# Altium schematic sheet sma-amplifier.SchDoc: SMA Amplifier
size A4; DrawnBy: Dylan Vogel; Organization: UTAT SS; DocumentNumber: 12; Revision: 2; SheetNumber: 12; SheetTotal: 13
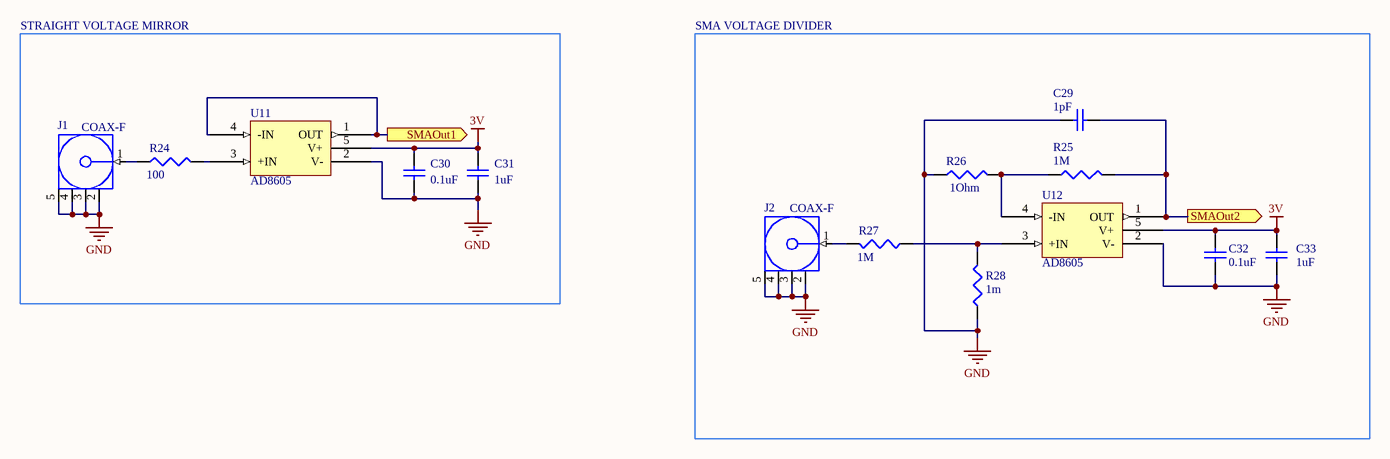
[diagram p0: sma-amplifier.SchDoc]

## Parts
C29  1pF  [0402]
C30  0.1uF  [0402]
C31  1uF  [1608[0603]]
C32  0.1uF  [0402]
C33  1uF  [1608[0603]]
J1  COAX-F  [MCX5.08-H5]
J2  COAX-F  [MCX5.08-H5]
R24  100  [0402]
R25  1M  [0402]
R26  1Ohm  [J1-0603]
R27  1M  [0402]
R28  1m  [14-1210]
U11  AD8605  [SOP-65P200X125-5N]
U12  AD8605  [SOP-65P200X125-5N]

## Blocks framed on the sheet
STRAIGHT VOLTAGE MIRROR: C30 C31 J1 R24 U11
SMA VOLTAGE DIVIDER: C29 C32 C33 J2 R25-R28 U12

## Ports
SMAOut1 (out), SMAOut2 (out)

## Nets
3V: C30.2 C31.2 C32.2 C33.2 U11.5(V+) U12.5(V+)
GND: C29.2 C30.1 C31.1 C32.1 C33.1 J1.2(GND) J1.3(GND) J1.4(GND) J1.5(GND) J2.2(GND) J2.3(GND) J2.4(GND) J2.5(GND) R26.1 R28.1 U11.2(V-) U12.2(V-)
SMAOut1: U11.1(OUT) U11.4(-IN) ; port SMAOut1
SMAOut2: C29.1 R25.2 U12.1(OUT) ; port SMAOut2
NetJ1_1: J1.1(Signal) R24.1
NetJ2_1: J2.1(Signal) R27.2
NetR24_2: R24.2 U11.3(+IN)
NetR25_1: R25.1 R26.2 U12.4(-IN)
NetR27_1: R27.1 R28.2 U12.3(+IN)

## Library data of the parts
C29-C33 = Cap Semi: Capacitor (Semiconductor SIM Model); Published: 8-Jun-2000; LatestRevisionDate: 29-May-2009; LatestRevisionNote: IPC-7351 Footprint Added.; PackageReference: C1206; Publisher: Altium Limited; PackageDescription: Chip Capacitor; Supplier: Digi-Key; Supplier 1: Digi-Key
  C29: Value: 1pF
  C30 C32: Value: 0.1uF
  C31 C33: Value: 1uF
J1 J2 = COAX-F: RF Coaxial PCB Connector, MCX; Thru-Hole, Right-Angle Mount Socket, Blunt Post Terminal, 50 Ohm Impedance; PCB_Layout: Complies with manufacturer's recommendation.; DrillSize: Corresponds to nominal value.; Published: 15-Jul-2004; LatestRevisionDate: 15-Jul-2004; LatestRevisionNote: Component Replaced.; DatasheetDocument: 30-May-2003; PackageDocument: 04-Jul-1999; PackageReference: 919-119J-51AX; Publisher: Altium Limited; ComponentLink1Description: Manufacturer Link; ComponentLink1URL: http://www.amphenolrf.com/; Supplier 1: Digi-Key
R24-R28 = Res3: Resistor; Published: 8-Jun-2000; LatestRevisionDate: 29-May-2009; LatestRevisionNote: IPC-7351 Footprint Added.; PackageReference: J1-0603; Publisher: Altium Limited; PackageDescription: Chip Resistor; Supplier 1: Digi-Key
  R24: Value: 100
  R25 R27: Value: 1M
  R26: Value: 1Ohm
  R28: Value: 1m
U11 U12 = AD8605: Low noise, precision rail-to-rail op-amp.; Supplier 1: Digi-Key; Supplier Part Number 1: AD8605ARTZREEL7CT-ND; Supplier: Digi-Key